# EAGLE schematic glove-pcb (EAGLE 7.6.0)
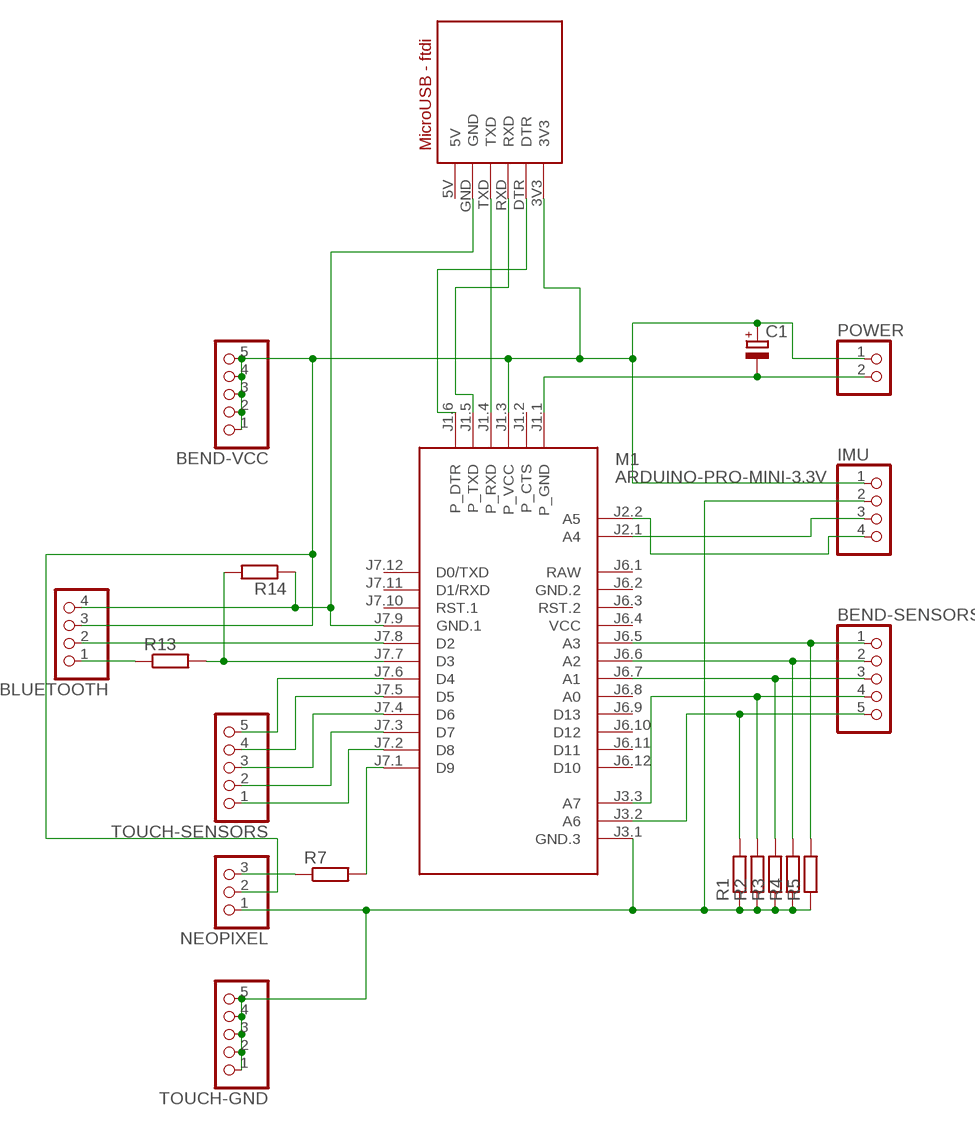
[diagram p0: schematic, sheet 1]

## Parts
BEND-SENSORS  PINHD-1X5  [1X05]
BEND-VCC  PINHD-1X5  [1X05]
BLUETOOTH  PINHD-1X4  [1X04]
C1  CPOL-EUE2-5  [E2-5]
IMU  PINHD-1X4  [1X04]
M1  ARDUINO-PRO-MINI-3.3V  [ARDUINO-PRO-MINI]
NEOPIXEL  PINHD-1X3  [1X03]
POWER  PINHD-1X2  [1X02]
R1  R-EU_0204/7  [0204/7]
R2  R-EU_0204/7  [0204/7]
R3  R-EU_0204/7  [0204/7]
R4  R-EU_0204/7  [0204/7]
R5  R-EU_0204/7  [0204/7]
R7  R-EU_0204/2V  [0204V]
R13  R-EU_0204/2V  [0204V]
R14  R-EU_0204/2V  [0204V]
TOUCH-GND  PINHD-1X5  [1X05]
TOUCH-SENSORS  PINHD-1X5  [1X05]
U$1  MICRO-USB-DEV  [MICRO-USB-PAC]

## Nets
N$1: NEOPIXEL.3 R7.1
N$2: IMU.3 M1.J2.1(A4)
N$3: M1.J7.1(D9) R7.2
N$4: IMU.4 M1.J2.2(A5)
N$6: M1.J1.4(P_RXD) U$1.TXD
N$7: M1.J1.5(P_TXD) U$1.RXD
N$8: BLUETOOTH.1 R13.1
N$9: BLUETOOTH.2 M1.J7.8(D2)
N$10: BEND-SENSORS.1 M1.J6.5(A3) R5.2
N$11: BLUETOOTH.4 M1.J7.9(GND.1) R14.1 U$1.GND
N$12: IMU.2 M1.J3.1(GND.3) NEOPIXEL.1 R1.1 R2.1 R3.1 R4.1 R5.1 TOUCH-GND.1 TOUCH-GND.2 TOUCH-GND.3 TOUCH-GND.4 TOUCH-GND.5
N$13: M1.J7.2(D8) TOUCH-SENSORS.1
N$14: M1.J7.3(D7) TOUCH-SENSORS.2
N$15: C1.- M1.J1.1(P_GND) POWER.2
N$16: M1.J7.4(D6) TOUCH-SENSORS.3
N$17: M1.J7.5(D5) TOUCH-SENSORS.4
N$18: M1.J7.6(D4) TOUCH-SENSORS.5
N$19: BEND-SENSORS.2 M1.J6.6(A2) R4.2
N$20: BEND-SENSORS.3 M1.J6.7(A1) R3.2
N$21: BEND-SENSORS.4 M1.J3.3(A7) R2.2
N$22: BEND-SENSORS.5 M1.J3.2(A6) R1.2
N$23: M1.J7.7(D3) R13.2 R14.2
N$24: M1.J1.6(P_DTR) U$1.DTR
N$25: BEND-VCC.1 BEND-VCC.2 BEND-VCC.3 BEND-VCC.4 BEND-VCC.5 BLUETOOTH.3 C1.+ IMU.1 M1.J1.3(P_VCC) NEOPIXEL.2 POWER.1 U$1.3V3
Unconnected: M1.J1.2(P_CTS) M1.J6.3(RST.2) M1.J6.8(A0) M1.J6.9(D13) M1.J6.10(D12) M1.J6.11(D11) M1.J6.12(D10) M1.J7.10(RST.1) M1.J7.11(D1/RXD) M1.J7.12(D0/TXD)

## Power pins joined to a net without a drawn wire
5V: U$1.5V
GND.2: M1.J6.2(GND.2)
RAW: M1.J6.1(RAW)
VCC: M1.J6.4(VCC)

## Library data of the parts
BEND-SENSORS BEND-VCC TOUCH-GND TOUCH-SENSORS = pinhead:PINHD-1X5: PIN HEADER
BLUETOOTH IMU = pinhead:PINHD-1X4: PIN HEADER
C1 = rcl:CPOL-EU: POLARIZED CAPACITOR, European symbol
M1 = diy-modules:ARDUINO-PRO-MINI-*: Arduino Pro Mini
NEOPIXEL = pinhead:PINHD-1X3: PIN HEADER
POWER = pinhead:PINHD-1X2: PIN HEADER
R1-R5 R7 R13 R14 = resistor:R-EU_: RESISTOR, European symbol
U$1 = Dr_Burrows_library:MICRO-USB-DEV: MicroUSB FTDI Programmer